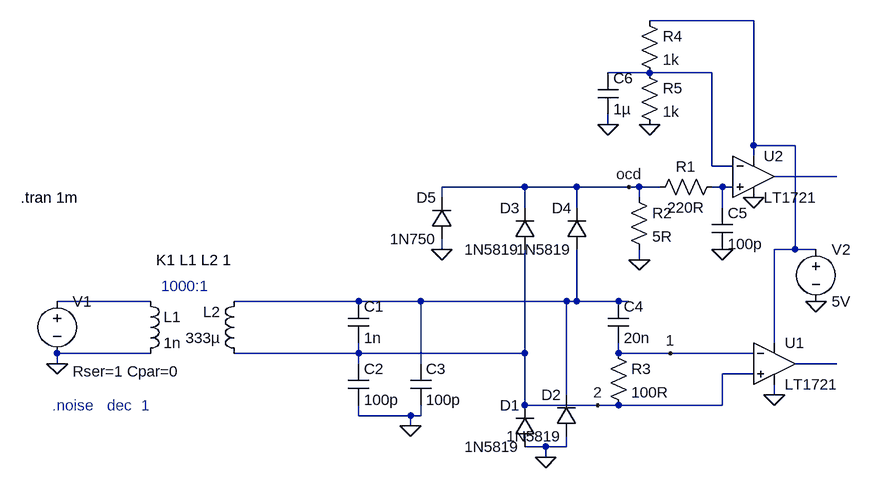
[diagram p0: schematic Feedback_sym.asc]
Feedback_sym.asc, the LTspice schematic file:
Version 4.1
SHEET 1 1432 680
WIRE 1088 -320 928 -320
WIRE 928 -240 864 -240
WIRE 1024 -240 928 -240
WIRE 864 -160 864 -176
WIRE 1088 -128 1088 -320
WIRE 1152 -128 1088 -128
WIRE 1088 -112 1088 -128
WIRE 1024 -96 1024 -240
WIRE 1056 -96 1024 -96
WIRE 1216 -80 1120 -80
WIRE 736 -64 608 -64
WIRE 816 -64 736 -64
WIRE 896 -64 816 -64
WIRE 912 -64 896 -64
WIRE 944 -64 912 -64
WIRE 1040 -64 1024 -64
WIRE 1056 -64 1040 -64
WIRE 608 -48 608 -64
WIRE 912 -48 912 -64
WIRE 736 -32 736 -64
WIRE 816 -32 816 -64
WIRE 1040 -32 1040 -64
WIRE 608 32 608 16
WIRE 1152 32 1152 -128
WIRE 1152 32 1120 32
WIRE 1184 32 1152 32
WIRE 912 48 912 32
WIRE 160 112 16 112
WIRE 480 112 288 112
WIRE 576 112 480 112
WIRE 800 112 576 112
WIRE 816 112 816 32
WIRE 816 112 800 112
WIRE 880 112 816 112
WIRE 896 112 880 112
WIRE 1120 176 1120 32
WIRE 160 192 16 192
WIRE 480 192 480 176
WIRE 480 192 288 192
WIRE 736 192 736 32
WIRE 736 192 480 192
WIRE 880 192 880 176
WIRE 960 192 880 192
WIRE 1088 192 960 192
WIRE 16 208 16 192
WIRE 480 208 480 192
WIRE 576 208 576 112
WIRE 1216 208 1152 208
WIRE 1088 224 1040 224
WIRE 800 256 800 112
WIRE 1120 256 1120 240
WIRE 736 272 736 192
WIRE 848 272 736 272
WIRE 880 272 848 272
WIRE 1040 272 1040 224
WIRE 1040 272 880 272
WIRE 480 288 480 272
WIRE 560 288 480 288
WIRE 576 288 576 272
WIRE 576 288 560 288
WIRE 560 304 560 288
WIRE 768 336 736 336
WIRE 800 336 800 320
WIRE 800 336 768 336
WIRE 768 352 768 336
FLAG 912 48 0
FLAG 896 -64 ocd
FLAG 16 208 0
FLAG 768 352 0
FLAG 560 304 0
FLAG 960 192 1
FLAG 848 272 2
FLAG 1120 256 0
FLAG 1184 112 0
FLAG 608 32 0
FLAG 1088 -48 0
FLAG 1040 32 0
FLAG 928 -160 0
FLAG 864 -160 0
SYMBOL ind 144 96 R0
SYMATTR InstName L1
SYMATTR Value 1n
SYMATTR Type ind
SYMBOL ind 304 208 R180
WINDOW 0 36 80 Left 2
WINDOW 3 36 40 Left 2
SYMATTR InstName L2
SYMATTR Value 333µ
SYMATTR Type ind
SYMBOL cap 464 112 R0
SYMATTR InstName C1
SYMATTR Value 1n
SYMBOL cap 464 208 R0
SYMATTR InstName C2
SYMATTR Value 100p
SYMBOL cap 560 208 R0
SYMATTR InstName C3
SYMATTR Value 100p
SYMBOL diode 752 32 R180
WINDOW 0 24 64 Left 2
WINDOW 3 24 0 Left 2
SYMATTR InstName D3
SYMATTR Value 1N5819
SYMATTR Description Diode
SYMATTR Type diode
SYMBOL diode 832 32 R180
WINDOW 0 24 64 Left 2
WINDOW 3 24 0 Left 2
SYMATTR InstName D4
SYMATTR Value 1N5819
SYMATTR Description Diode
SYMATTR Type diode
SYMBOL diode 624 16 R180
WINDOW 0 24 64 Left 2
WINDOW 3 24 0 Left 2
SYMATTR InstName D5
SYMATTR Value 1N750
SYMATTR Description Diode
SYMATTR Type diode
SYMBOL voltage 16 96 R0
WINDOW 3 24 96 Invisible 2
WINDOW 123 24 152 Left 2
WINDOW 39 24 124 Left 2
SYMATTR InstName V1
SYMATTR Value SINE(0 500 100k 0 0 0 100)
SYMATTR SpiceLine Rser=1 Cpar=0
SYMBOL cap 864 112 R0
SYMATTR InstName C4
SYMATTR Value 20n
SYMBOL res 864 176 R0
SYMATTR InstName R3
SYMATTR Value 100R
SYMBOL diode 752 336 R180
WINDOW 0 24 64 Left 2
WINDOW 3 24 0 Left 2
SYMATTR InstName D1
SYMATTR Value 1N5819
SYMATTR Description Diode
SYMATTR Type diode
SYMBOL diode 816 320 R180
WINDOW 0 24 64 Left 2
WINDOW 3 24 0 Left 2
SYMATTR InstName D2
SYMATTR Value 1N5819
SYMATTR Description Diode
SYMATTR Type diode
SYMBOL res 896 -64 R0
SYMATTR InstName R2
SYMATTR Value 5R
SYMBOL voltage 1184 16 R0
WINDOW 123 0 0 Left 0
WINDOW 39 0 0 Left 0
SYMATTR InstName V2
SYMATTR Value 5V
SYMBOL Comparators\\LT1721 1120 144 R0
SYMATTR InstName U1
SYMBOL Comparators\\LT1721 1088 -144 R0
SYMATTR InstName U2
SYMBOL res 1040 -80 R90
WINDOW 0 0 56 VBottom 2
WINDOW 3 32 56 VTop 2
SYMATTR InstName R1
SYMATTR Value 220R
SYMBOL cap 1024 -32 R0
SYMATTR InstName C5
SYMATTR Value 100p
SYMBOL res 912 -336 R0
SYMATTR InstName R4
SYMATTR Value 1k
SYMBOL res 912 -256 R0
SYMATTR InstName R5
SYMATTR Value 1k
SYMBOL cap 848 -240 R0
SYMATTR InstName C6
SYMATTR Value 1µ
TEXT 176 88 Left 2 ;1000:1
TEXT -40 -48 Left 2 !.tran 1m
TEXT 168 48 Left 2 !K1 L1 L2 1
TEXT 8 272 Left 2 ;.noise   dec  1

The netlist it stands for:
* Feedback_sym.asc
L1 N005 0 1n
L2 2 N006 333µ
C1 N006 2 1n
C2 2 0 100p
C3 N006 0 100p
D3 2 ocd 1N5819
D4 N006 ocd 1N5819
D5 0 ocd 1N750
V1 N005 0 SINE(0 500 100k 0 0 0 100) Rser=1 Cpar=0
C4 N006 1 20n
R3 1 2 100R
D1 0 2 1N5819
D2 0 N006 1N5819
R2 ocd 0 5R
V2 N001 0 5V
X§U1 2 1 N001 0 N007 LT1720  ; LT1721, pins In+ In- V+ V- OUT
X§U2 N004 N002 N001 0 N003 LT1720  ; LT1721, pins In+ In- V+ V- OUT
R1 N004 ocd 220R
C5 N004 0 100p
R4 N001 N002 1k
R5 N002 0 1k
C6 N002 0 1µ
.model D D
.lib standard.dio
* 1000:1
.tran 1m
K1 L1 L2 1
* .noise   dec  1
.lib LTC.lib
.backanno
.end